# Altium schematic sheet PWJACK+SWITCH.SchDoc: Power Jack & Switch
size A4; Organization: Altium Limited.; Address1: Level 3, 12a Rodborough Rd; Address2: Frenchs Forest 2086; Address3: NSW; Address4: AUSTRALIA; DocumentNumber: 20; Revision: 6; SheetNumber: 21; SheetTotal: 78
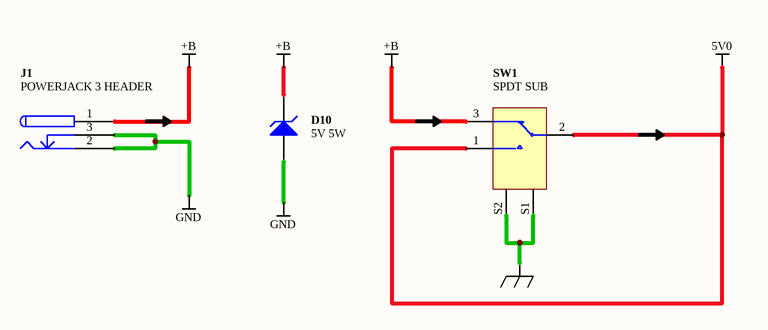
[diagram p0: PWJACK+SWITCH.SchDoc]

## Parts
D10  5V 5W  [DIOM8059]
J1  POWERJACK 3 HEADER  [KLD-0202]
SW1  SPDT SUB  [T8019L-TNQ]

## Nets
5V0: SW1.1 SW1.2
+B: D10.2(K) J1.1 SW1.3
GND: D10.1(A) J1.2 J1.3
SHIELD: SW1.S1 SW1.S2

## Notes on the sheet
- Sheet Title
- Project Title
- Size:
- Date:
- A4
- Assy:
- Time:
- Revision:
- Sheet
- of
- File:

## Library data of the parts
D10 = D-150-0001: Zener Diode, 5V 5W; Max Forward Current: mA; Rated Voltage: mV; Category: Diode-Zener; Mounting Technology: Surface Mount; Status: Production
J1 = D-300-0007: Connector, 3 Conductor Power Jack 2 break 2 aux contacts; ClassName: COMP_5V0; Category: Connector; Connector type: POWERJACK 3 HEADER; Status: Production
SW1 = D-301-0000: Switch, SPDT Subminiature Toggle; ClassName: COMP_5V0; Category: Switch; Status: Production